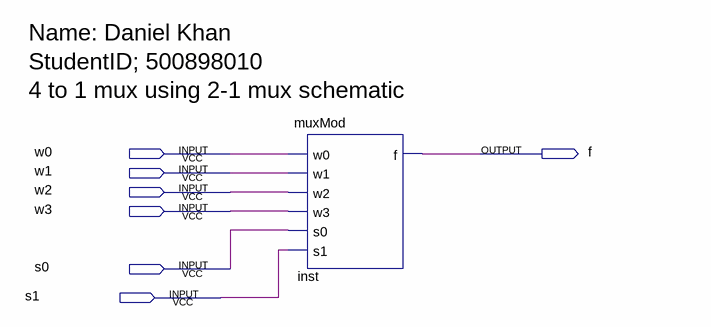
[diagram p0: schematic sheet]
// Quartus schematic modifiedmux.bdf as structural Verilog: 1 symbols, 7 pins
module modifiedmux (
  input  w0,
  input  w1,
  input  w2,
  input  w3,
  input  s0,
  input  s1,
  output f
);

  muxMod inst (.w0(w0), .w1(w1), .w2(w2), .w3(w3), .s0(s0), .s1(s1), .f(f));

  // Notes on the sheet:
  //   Name: Daniel Khan
  //   StudentID; 500898010
  //   4 to 1 mux using 2-1 mux schematic
endmodule
